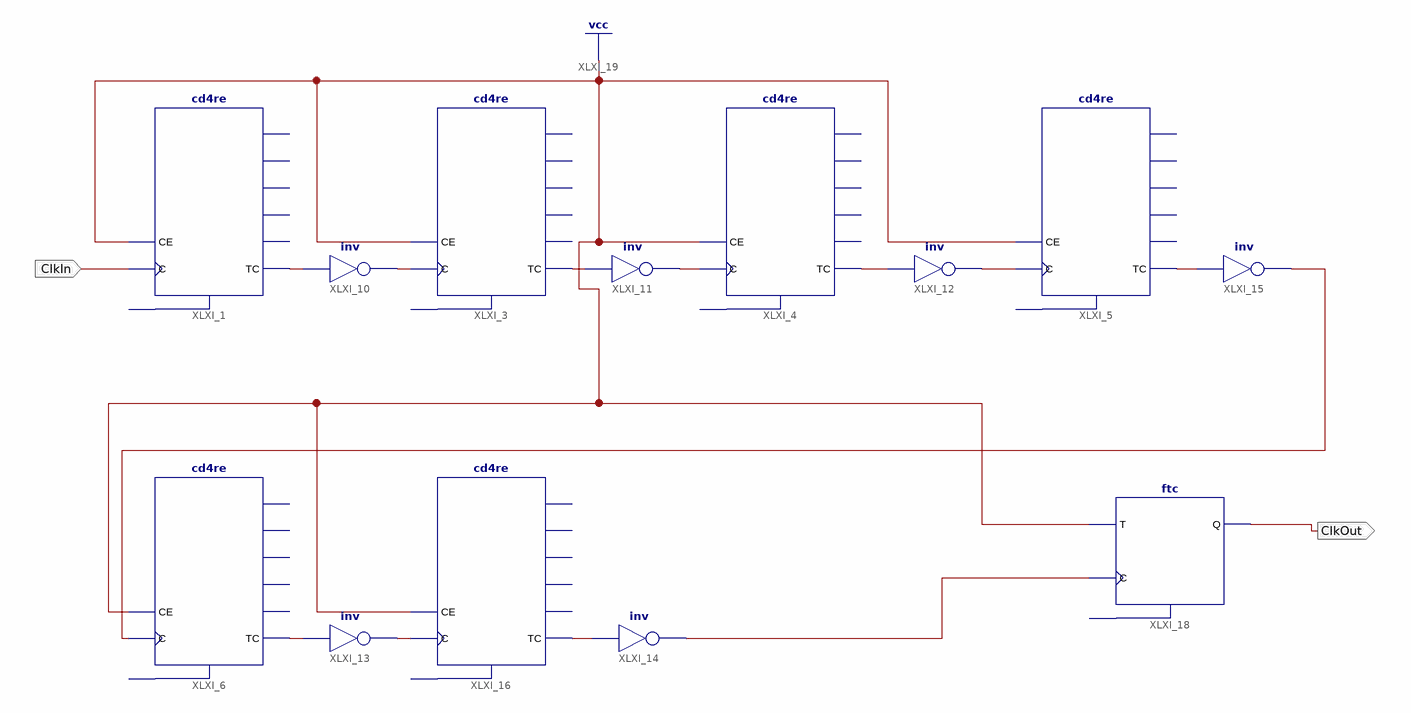
[diagram p0: schematic sheet 1]
// Xilinx ISE schematic divide20M.sch (spartan6) as structural Verilog: 13 symbols, 2 ports
module divide20M (
  input  ClkIn,
  output ClkOut
);

  wire XLXN_1, XLXN_8, XLXN_9, XLXN_13, XLXN_16, XLXN_17, XLXN_19, XLXN_21, XLXN_22, XLXN_25, XLXN_26,
       XLXN_27;

  cd4re XLXI_1 (.C(ClkIn), .CE(1'b1), .TC(XLXN_1));  // open: R, CEO, Q0, Q1, Q2, Q3
  cd4re XLXI_3 (.C(XLXN_13), .CE(1'b1), .TC(XLXN_16));  // open: R, CEO, Q0, Q1, Q2, Q3
  cd4re XLXI_4 (.C(XLXN_17), .CE(1'b1), .TC(XLXN_21));  // open: R, CEO, Q0, Q1, Q2, Q3
  cd4re XLXI_6 (.C(XLXN_8), .CE(1'b1), .TC(XLXN_9));  // open: R, CEO, Q0, Q1, Q2, Q3
  not XLXI_11 (XLXN_17, XLXN_16);
  not XLXI_12 (XLXN_22, XLXN_21);
  not XLXI_13 (XLXN_26, XLXN_9);
  not XLXI_14 (XLXN_27, XLXN_25);
  not XLXI_15 (XLXN_8, XLXN_19);
  not XLXI_10 (XLXN_13, XLXN_1);
  cd4re XLXI_5 (.C(XLXN_22), .CE(1'b1), .TC(XLXN_19));  // open: R, CEO, Q0, Q1, Q2, Q3
  cd4re XLXI_16 (.C(XLXN_26), .CE(1'b1), .TC(XLXN_25));  // open: R, CEO, Q0, Q1, Q2, Q3
  ftc XLXI_18 (.C(XLXN_27), .T(1'b1), .Q(ClkOut));  // open: CLR
endmodule
